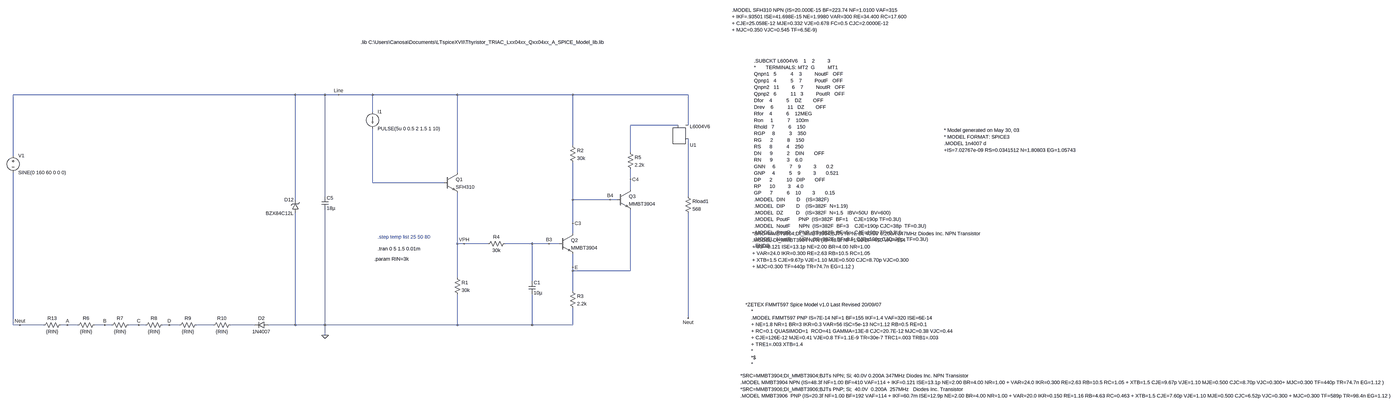
[diagram p0: schematic odin_d_110_220_AC.asc, whole sheet]
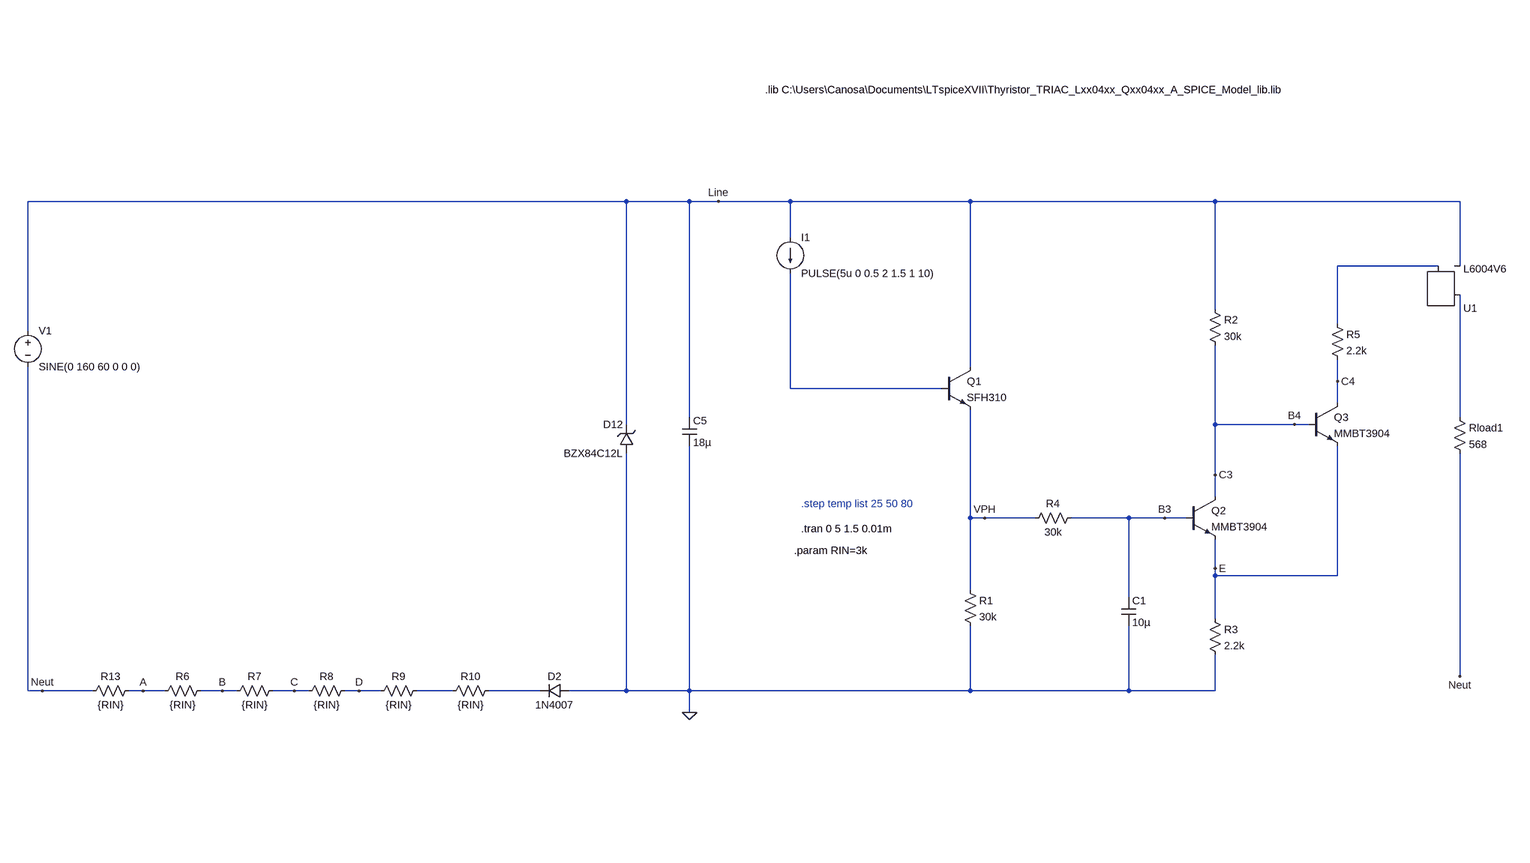
[diagram p1: schematic odin_d_110_220_AC.asc, part, row 1 of 1, column 1 of 2]
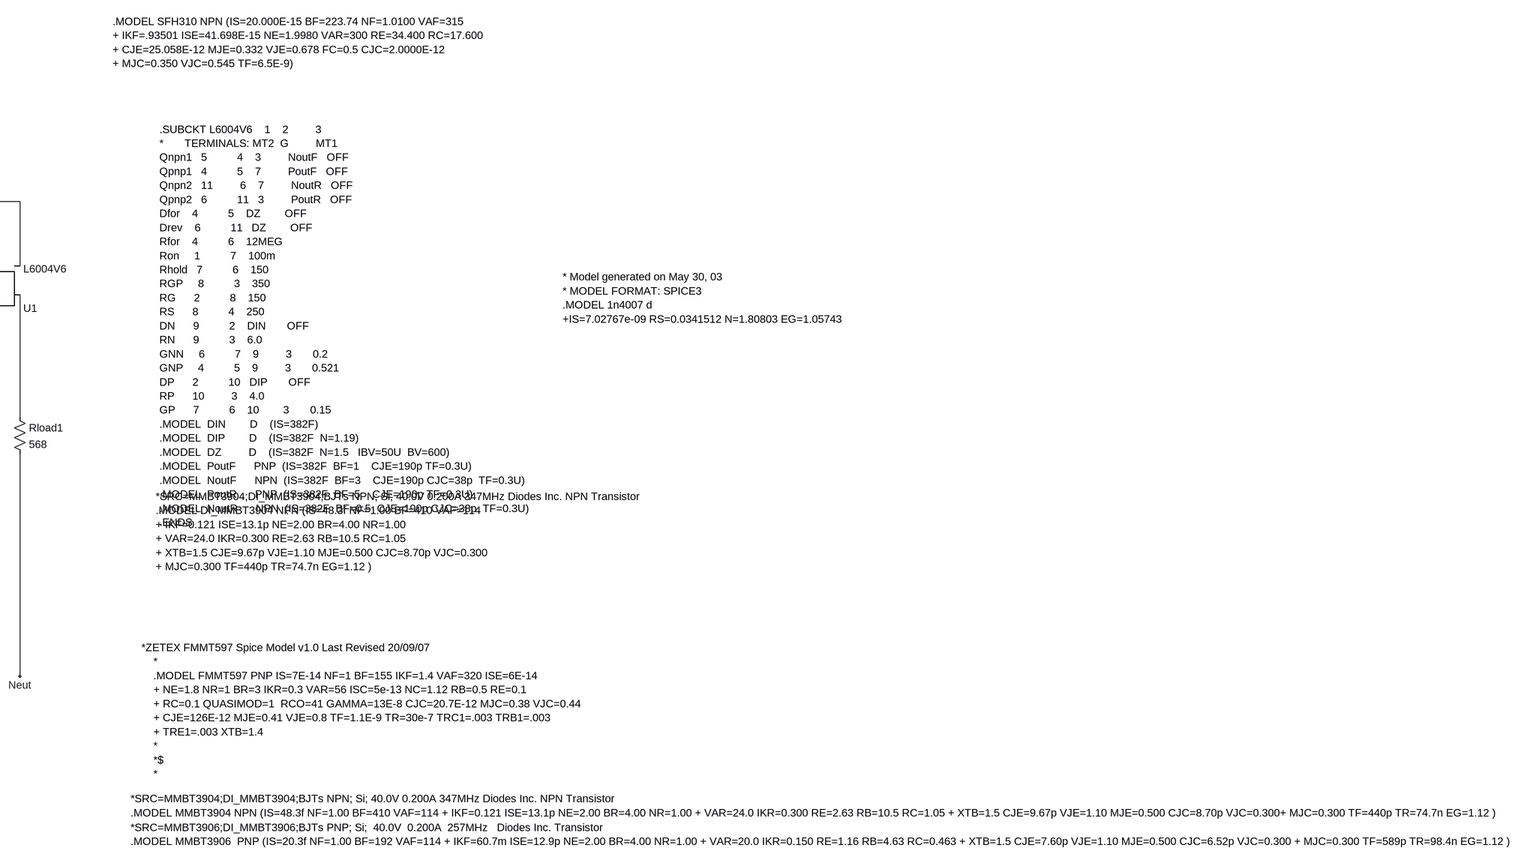
[diagram p2: schematic odin_d_110_220_AC.asc, part, row 1 of 1, column 2 of 2]
odin_d_110_220_AC.asc, the LTspice schematic file:
Version 4
SHEET 1 2308 1004
WIRE -4224 -720 -5616 -720
WIRE -3904 -720 -4224 -720
WIRE -3840 -720 -3904 -720
WIRE -3680 -720 -3840 -720
WIRE -3280 -720 -3680 -720
WIRE -2736 -720 -3280 -720
WIRE -2192 -720 -2736 -720
WIRE -3680 -640 -3680 -720
WIRE -2240 -576 -2464 -576
WIRE -2192 -576 -2192 -720
WIRE -2736 -480 -2736 -720
WIRE -2464 -448 -2464 -576
WIRE -5616 -432 -5616 -720
WIRE -3280 -352 -3280 -720
WIRE -2464 -320 -2464 -368
WIRE -3680 -304 -3680 -560
WIRE -3344 -304 -3680 -304
WIRE -2464 -272 -2464 -320
WIRE -3904 -240 -3904 -720
WIRE -2192 -240 -2192 -512
WIRE -4224 -224 -4224 -720
WIRE -2736 -224 -2736 -400
WIRE -2560 -224 -2736 -224
WIRE -2528 -224 -2560 -224
WIRE -2736 -112 -2736 -224
WIRE -2736 -64 -2736 -112
WIRE -3280 -16 -3280 -256
WIRE -3248 -16 -3280 -16
WIRE -3136 -16 -3248 -16
WIRE -2928 -16 -3056 -16
WIRE -2848 -16 -2928 -16
WIRE -2800 -16 -2848 -16
WIRE -2736 96 -2736 32
WIRE -2736 112 -2736 96
WIRE -2464 112 -2464 -176
WIRE -2464 112 -2736 112
WIRE -3280 144 -3280 -16
WIRE -2928 160 -2928 -16
WIRE -2736 208 -2736 112
WIRE -2192 336 -2192 -160
WIRE -5616 368 -5616 -352
WIRE -5584 368 -5616 368
WIRE -5472 368 -5584 368
WIRE -5360 368 -5392 368
WIRE -5312 368 -5360 368
WIRE -5184 368 -5232 368
WIRE -5152 368 -5184 368
WIRE -5024 368 -5072 368
WIRE -4992 368 -5024 368
WIRE -4880 368 -4912 368
WIRE -4832 368 -4880 368
WIRE -4672 368 -4752 368
WIRE -4416 368 -4592 368
WIRE -4224 368 -4224 -160
WIRE -4224 368 -4352 368
WIRE -3904 368 -3904 -176
WIRE -3904 368 -4224 368
WIRE -3280 368 -3280 224
WIRE -3280 368 -3904 368
WIRE -2928 368 -2928 224
WIRE -2928 368 -3280 368
WIRE -2736 368 -2736 288
WIRE -2736 368 -2928 368
WIRE -3904 416 -3904 368
FLAG -3904 416 0
FLAG -3840 -720 Line
FLAG -5584 368 Neut
FLAG -2192 336 Neut
FLAG -3248 -16 VPH
FLAG -2736 -112 C3
FLAG -2464 -320 C4
FLAG -2848 -16 B3
FLAG -2560 -224 B4
FLAG -2736 96 E
FLAG -5360 368 A
FLAG -5184 368 B
FLAG -5024 368 C
FLAG -4880 368 D
SYMBOL res -5376 352 R90
WINDOW 0 0 56 VBottom 2
WINDOW 3 32 56 VTop 2
SYMATTR InstName R13
SYMATTR Value {RIN}
SYMBOL zener -4208 -160 R180
WINDOW 0 24 64 Left 2
WINDOW 3 24 0 Left 2
SYMATTR InstName D12
SYMATTR Value BZX84C12L
SYMBOL cap -3920 -240 R0
SYMATTR InstName C5
SYMATTR Value 18µ
SYMBOL diode -4352 352 R90
WINDOW 0 0 32 VBottom 2
WINDOW 3 32 32 VTop 2
SYMATTR InstName D2
SYMATTR Value 1N4007
SYMBOL voltage -5616 -448 R0
WINDOW 123 0 0 Left 0
WINDOW 39 0 0 Left 0
SYMATTR InstName V1
SYMATTR Value SINE(0 160 60 0 0 0)
SYMBOL npn -3344 -352 R0
SYMATTR InstName Q1
SYMATTR Value SFH310
SYMBOL res -3296 128 R0
SYMATTR InstName R1
SYMATTR Value 30k
SYMBOL res -2752 -496 R0
SYMATTR InstName R2
SYMATTR Value 30k
SYMBOL res -2752 192 R0
SYMATTR InstName R3
SYMATTR Value 2.2k
SYMBOL npn -2800 -64 R0
SYMATTR InstName Q2
SYMATTR Value MMBT3904
SYMBOL npn -2528 -272 R0
SYMATTR InstName Q3
SYMATTR Value MMBT3904
SYMBOL res -3040 -32 R90
WINDOW 0 0 56 VBottom 2
WINDOW 3 32 56 VTop 2
SYMATTR InstName R4
SYMATTR Value 30k
SYMBOL Misc\\TRIAC -2224 -512 M180
SYMATTR InstName U1
SYMATTR Value L6004V6
SYMBOL res -2208 -256 R0
SYMATTR InstName Rload1
SYMATTR Value 568
SYMBOL current -3680 -640 R0
WINDOW 123 0 0 Left 0
WINDOW 39 0 0 Left 0
SYMATTR InstName I1
SYMATTR Value PULSE(5u 0 0.5 2 1.5 1 10)
SYMBOL res -2480 -464 R0
SYMATTR InstName R5
SYMATTR Value 2.2k
SYMBOL cap -2944 160 R0
SYMATTR InstName C1
SYMATTR Value 10µ
SYMBOL res -5216 352 R90
WINDOW 0 0 56 VBottom 2
WINDOW 3 32 56 VTop 2
SYMATTR InstName R6
SYMATTR Value {RIN}
SYMBOL res -5056 352 R90
WINDOW 0 0 56 VBottom 2
WINDOW 3 32 56 VTop 2
SYMATTR InstName R7
SYMATTR Value {RIN}
SYMBOL res -4896 352 R90
WINDOW 0 0 56 VBottom 2
WINDOW 3 32 56 VTop 2
SYMATTR InstName R8
SYMATTR Value {RIN}
SYMBOL res -4736 352 R90
WINDOW 0 0 56 VBottom 2
WINDOW 3 32 56 VTop 2
SYMATTR InstName R9
SYMATTR Value {RIN}
SYMBOL res -4576 352 R90
WINDOW 0 0 56 VBottom 2
WINDOW 3 32 56 VTop 2
SYMATTR InstName R10
SYMATTR Value {RIN}
TEXT -3736 -968 Left 2 !.lib C:\\Users\\Canosa\\Documents\\LTspiceXVII\\Thyristor_TRIAC_Lxx04xx_Qxx04xx_A_SPICE_Model_lib.lib
TEXT -912 -880 Left 2 !.SUBCKT L6004V6    1    2         3\n*       TERMINALS: MT2  G         MT1\nQnpn1   5          4    3         NoutF   OFF\nQpnp1   4          5    7         PoutF   OFF\nQnpn2   11         6    7         NoutR   OFF\nQpnp2   6          11   3         PoutR   OFF\nDfor    4          5    DZ        OFF\nDrev    6          11   DZ        OFF\nRfor    4          6    12MEG\nRon     1          7    100m\nRhold   7          6    150\nRGP     8          3    350\nRG      2          8    150\nRS      8          4    250\nDN      9          2    DIN       OFF\nRN      9          3    6.0\nGNN     6          7    9         3       0.2\nGNP     4          5    9         3       0.521\nDP      2          10   DIP       OFF\nRP      10         3    4.0\nGP      7          6    10        3       0.15\n.MODEL  DIN        D    (IS=382F)\n.MODEL  DIP        D    (IS=382F  N=1.19)\n.MODEL  DZ         D    (IS=382F  N=1.5   IBV=50U  BV=600)\n.MODEL  PoutF      PNP  (IS=382F  BF=1    CJE=190p TF=0.3U)\n.MODEL  NoutF      NPN  (IS=382F  BF=3    CJE=190p CJC=38p  TF=0.3U)\n.MODEL  PoutR      PNP  (IS=382F  BF=5    CJE=190p TF=0.3U)\n.MODEL  NoutR      NPN  (IS=382F  BF=0.5  CJE=190p CJC=38p  TF=0.3U)\n.ENDS
TEXT -1016 -1120 Left 2 !.MODEL SFH310 NPN (IS=20.000E-15 BF=223.74 NF=1.0100 VAF=315\n+ IKF=.93501 ISE=41.698E-15 NE=1.9980 VAR=300 RE=34.400 RC=17.600\n+ CJE=25.058E-12 MJE=0.332 VJE=0.678 FC=0.5 CJC=2.0000E-12\n+ MJC=0.350 VJC=0.545 TF=6.5E-9)
TEXT -16 -552 Left 2 !* Model generated on May 30, 03\n* MODEL FORMAT: SPICE3\n.MODEL 1n4007 d\n+IS=7.02767e-09 RS=0.0341512 N=1.80803 EG=1.05743
TEXT -920 -64 Left 2 !*SRC=MMBT3904;DI_MMBT3904;BJTs NPN; Si; 40.0V 0.200A 347MHz Diodes Inc. NPN Transistor\n.MODEL DI_MMBT3904 NPN (IS=48.3f NF=1.00 BF=410 VAF=114\n+ IKF=0.121 ISE=13.1p NE=2.00 BR=4.00 NR=1.00\n+ VAR=24.0 IKR=0.300 RE=2.63 RB=10.5 RC=1.05\n+ XTB=1.5 CJE=9.67p VJE=1.10 MJE=0.500 CJC=8.70p VJC=0.300\n+ MJC=0.300 TF=440p TR=74.7n EG=1.12 )
TEXT -976 608 Left 2 !*SRC=MMBT3904;DI_MMBT3904;BJTs NPN; Si; 40.0V 0.200A 347MHz Diodes Inc. NPN Transistor\n.MODEL MMBT3904 NPN (IS=48.3f NF=1.00 BF=410 VAF=114 + IKF=0.121 ISE=13.1p NE=2.00 BR=4.00 NR=1.00 + VAR=24.0 IKR=0.300 RE=2.63 RB=10.5 RC=1.05 + XTB=1.5 CJE=9.67p VJE=1.10 MJE=0.500 CJC=8.70p VJC=0.300+ MJC=0.300 TF=440p TR=74.7n EG=1.12 )
TEXT -976 672 Left 2 !*SRC=MMBT3906;DI_MMBT3906;BJTs PNP; Si;  40.0V  0.200A  257MHz   Diodes Inc. Transistor\n.MODEL MMBT3906  PNP (IS=20.3f NF=1.00 BF=192 VAF=114 + IKF=60.7m ISE=12.9p NE=2.00 BR=4.00 NR=1.00 + VAR=20.0 IKR=0.150 RE=1.16 RB=4.63 RC=0.463 + XTB=1.5 CJE=7.60p VJE=1.10 MJE=0.500 CJC=6.52p VJC=0.300 + MJC=0.300 TF=589p TR=98.4n EG=1.12 )
TEXT -952 272 Left 2 !*ZETEX FMMT597 Spice Model v1.0 Last Revised 20/09/07\n    *\n    .MODEL FMMT597 PNP IS=7E-14 NF=1 BF=155 IKF=1.4 VAF=320 ISE=6E-14\n    + NE=1.8 NR=1 BR=3 IKR=0.3 VAR=56 ISC=5e-13 NC=1.12 RB=0.5 RE=0.1\n    + RC=0.1 QUASIMOD=1  RCO=41 GAMMA=13E-8 CJC=20.7E-12 MJC=0.38 VJC=0.44\n    + CJE=126E-12 MJE=0.41 VJE=0.8 TF=1.1E-9 TR=30e-7 TRC1=.003 TRB1=.003\n    + TRE1=.003 XTB=1.4\n    *\n    *$\n    *
TEXT -3656 8 Left 2 !.tran 0 5 1.5 0.01m
TEXT -3656 -48 Left 2 ;.step temp list 25 50 80
TEXT -3672 56 Left 2 !.param RIN=3k

The netlist it stands for:
* odin_d_110_220_AC.asc
R13 A Neut {RIN}
D12 0 Line BZX84C12L
C5 Line 0 18µ
D2 0 N005 1N4007
V1 Line Neut SINE(0 160 60 0 0 0)
Q1 Line N002 VPH 0 SFH310
R1 VPH 0 30k
R2 Line B4 30k
R3 E 0 2.2k
Q2 B4 B3 E 0 MMBT3904
Q3 C4 B4 E 0 MMBT3904
R4 B3 VPH 30k
XU1 N003 N001 Line L6004V6  ; pins MT2 G MT1
Rload1 N003 Neut 568
I1 Line N002 PULSE(5u 0 0.5 2 1.5 1 10)
R5 N001 C4 2.2k
C1 B3 0 10µ
R6 B A {RIN}
R7 C B {RIN}
R8 D C {RIN}
R9 N004 D {RIN}
R10 N005 N004 {RIN}
.model D D
.lib standard.dio
.model NPN NPN
.model PNP PNP
.lib standard.bjt
.lib C:\Users\Canosa\Documents\LTspiceXVII\Thyristor_TRIAC_Lxx04xx_Qxx04xx_A_SPICE_Model_lib.lib
.SUBCKT L6004V6    1    2         3
*       TERMINALS: MT2  G         MT1
Qnpn1   5          4    3         NoutF   OFF
Qpnp1   4          5    7         PoutF   OFF
Qnpn2   11         6    7         NoutR   OFF
Qpnp2   6          11   3         PoutR   OFF
Dfor    4          5    DZ        OFF
Drev    6          11   DZ        OFF
Rfor    4          6    12MEG
Ron     1          7    100m
Rhold   7          6    150
RGP     8          3    350
RG      2          8    150
RS      8          4    250
DN      9          2    DIN       OFF
RN      9          3    6.0
GNN     6          7    9         3       0.2
GNP     4          5    9         3       0.521
DP      2          10   DIP       OFF
RP      10         3    4.0
GP      7          6    10        3       0.15
.MODEL  DIN        D    (IS=382F)
.MODEL  DIP        D    (IS=382F  N=1.19)
.MODEL  DZ         D    (IS=382F  N=1.5   IBV=50U  BV=600)
.MODEL  PoutF      PNP  (IS=382F  BF=1    CJE=190p TF=0.3U)
.MODEL  NoutF      NPN  (IS=382F  BF=3    CJE=190p CJC=38p  TF=0.3U)
.MODEL  PoutR      PNP  (IS=382F  BF=5    CJE=190p TF=0.3U)
.MODEL  NoutR      NPN  (IS=382F  BF=0.5  CJE=190p CJC=38p  TF=0.3U)
.ENDS
.MODEL SFH310 NPN (IS=20.000E-15 BF=223.74 NF=1.0100 VAF=315
+ IKF=.93501 ISE=41.698E-15 NE=1.9980 VAR=300 RE=34.400 RC=17.600
+ CJE=25.058E-12 MJE=0.332 VJE=0.678 FC=0.5 CJC=2.0000E-12
+ MJC=0.350 VJC=0.545 TF=6.5E-9)
* Model generated on May 30, 03
* MODEL FORMAT: SPICE3
.MODEL 1n4007 d
+IS=7.02767e-09 RS=0.0341512 N=1.80803 EG=1.05743
*SRC=MMBT3904;DI_MMBT3904;BJTs NPN; Si; 40.0V 0.200A 347MHz Diodes Inc. NPN Transistor
.MODEL DI_MMBT3904 NPN (IS=48.3f NF=1.00 BF=410 VAF=114
+ IKF=0.121 ISE=13.1p NE=2.00 BR=4.00 NR=1.00
+ VAR=24.0 IKR=0.300 RE=2.63 RB=10.5 RC=1.05
+ XTB=1.5 CJE=9.67p VJE=1.10 MJE=0.500 CJC=8.70p VJC=0.300
+ MJC=0.300 TF=440p TR=74.7n EG=1.12 )
*SRC=MMBT3904;DI_MMBT3904;BJTs NPN; Si; 40.0V 0.200A 347MHz Diodes Inc. NPN Transistor
.MODEL MMBT3904 NPN (IS=48.3f NF=1.00 BF=410 VAF=114 + IKF=0.121 ISE=13.1p NE=2.00 BR=4.00 NR=1.00 + VAR=24.0 IKR=0.300 RE=2.63 RB=10.5 RC=1.05 + XTB=1.5 CJE=9.67p VJE=1.10 MJE=0.500 CJC=8.70p VJC=0.300+ MJC=0.300 TF=440p TR=74.7n EG=1.12 )
*SRC=MMBT3906;DI_MMBT3906;BJTs PNP; Si;  40.0V  0.200A  257MHz   Diodes Inc. Transistor
.MODEL MMBT3906  PNP (IS=20.3f NF=1.00 BF=192 VAF=114 + IKF=60.7m ISE=12.9p NE=2.00 BR=4.00 NR=1.00 + VAR=20.0 IKR=0.150 RE=1.16 RB=4.63 RC=0.463 + XTB=1.5 CJE=7.60p VJE=1.10 MJE=0.500 CJC=6.52p VJC=0.300 + MJC=0.300 TF=589p TR=98.4n EG=1.12 )
*ZETEX FMMT597 Spice Model v1.0 Last Revised 20/09/07
    *
    .MODEL FMMT597 PNP IS=7E-14 NF=1 BF=155 IKF=1.4 VAF=320 ISE=6E-14
    + NE=1.8 NR=1 BR=3 IKR=0.3 VAR=56 ISC=5e-13 NC=1.12 RB=0.5 RE=0.1
    + RC=0.1 QUASIMOD=1  RCO=41 GAMMA=13E-8 CJC=20.7E-12 MJC=0.38 VJC=0.44
    + CJE=126E-12 MJE=0.41 VJE=0.8 TF=1.1E-9 TR=30e-7 TRC1=.003 TRB1=.003
    + TRE1=.003 XTB=1.4
    *
    *$
    *
.tran 0 5 1.5 0.01m
* .step temp list 25 50 80
.param RIN=3k
.backanno
.end